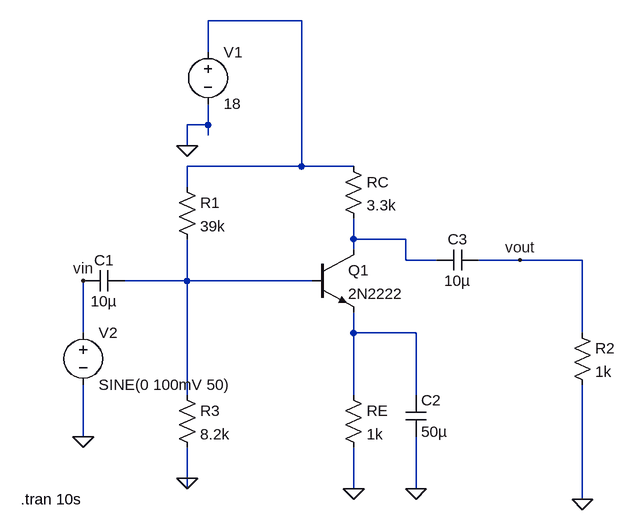
[diagram p0: schematic 4.4.asc]
4.4.asc, the LTspice schematic file:
Version 4
SHEET 1 884 896
WIRE 400 144 256 144
WIRE 256 192 256 144
WIRE 256 304 256 272
WIRE 256 304 224 304
WIRE 256 320 256 304
WIRE 224 336 224 304
WIRE 400 368 400 144
WIRE 400 368 224 368
WIRE 480 368 400 368
WIRE 224 400 224 368
WIRE 480 480 480 448
WIRE 560 480 480 480
WIRE 480 496 480 480
WIRE 560 512 560 480
WIRE 608 512 560 512
WIRE 736 512 672 512
WIRE 832 512 736 512
WIRE 224 544 224 480
WIRE 224 544 128 544
WIRE 416 544 224 544
WIRE 64 624 64 544
WIRE 480 624 480 592
WIRE 576 624 480 624
WIRE 832 624 832 512
WIRE 224 720 224 544
WIRE 480 720 480 624
WIRE 576 720 576 624
WIRE 64 784 64 704
WIRE 224 848 224 800
WIRE 224 864 224 848
WIRE 480 864 480 800
WIRE 576 864 576 784
WIRE 832 880 832 704
FLAG 224 848 0
FLAG 480 864 0
FLAG 576 864 0
FLAG 64 784 0
FLAG 736 512 vout
FLAG 64 544 vin
FLAG 224 336 0
FLAG 832 880 0
SYMBOL voltage 256 176 R0
SYMATTR InstName V1
SYMATTR Value 18
SYMBOL res 464 352 R0
SYMATTR InstName RC
SYMATTR Value 3.3k
SYMBOL res 208 384 R0
SYMATTR InstName R1
SYMATTR Value 39k
SYMBOL npn 416 496 R0
SYMATTR InstName Q1
SYMATTR Value 2N2222
SYMBOL cap 128 528 R90
WINDOW 0 0 32 VBottom 2
WINDOW 3 32 32 VTop 2
SYMATTR InstName C1
SYMATTR Value 10µ
SYMBOL cap 560 720 R0
SYMATTR InstName C2
SYMATTR Value 50µ
SYMBOL res 464 704 R0
SYMATTR InstName RE
SYMATTR Value 1k
SYMBOL res 208 704 R0
SYMATTR InstName R3
SYMATTR Value 8.2k
SYMBOL voltage 64 608 R0
SYMATTR InstName V2
SYMATTR Value SINE(0 100mV 50)
SYMBOL cap 672 496 R90
WINDOW 0 0 32 VBottom 2
WINDOW 3 32 32 VTop 2
SYMATTR InstName C3
SYMATTR Value 10µ
SYMBOL res 816 608 R0
SYMATTR InstName R2
SYMATTR Value 1k
TEXT -32 880 Left 2 !.tran 10s

The netlist it stands for:
* 4.4.asc
V1 N001 0 18
RC N001 N002 3.3k
R1 N001 N003 39k
Q1 N002 N003 N004 0 2N2222
C1 N003 vin 10µ
C2 N004 0 50µ
RE N004 0 1k
R3 N003 0 8.2k
V2 vin 0 SINE(0 100mV 50)
C3 vout N002 10µ
R2 vout 0 1k
.model NPN NPN
.model PNP PNP
.lib standard.bjt
.tran 10s
.backanno
.end